# EAGLE design ADE9000_ESP32_DevKitC (EAGLE 9.6.2)

## Sheet 1 of 2
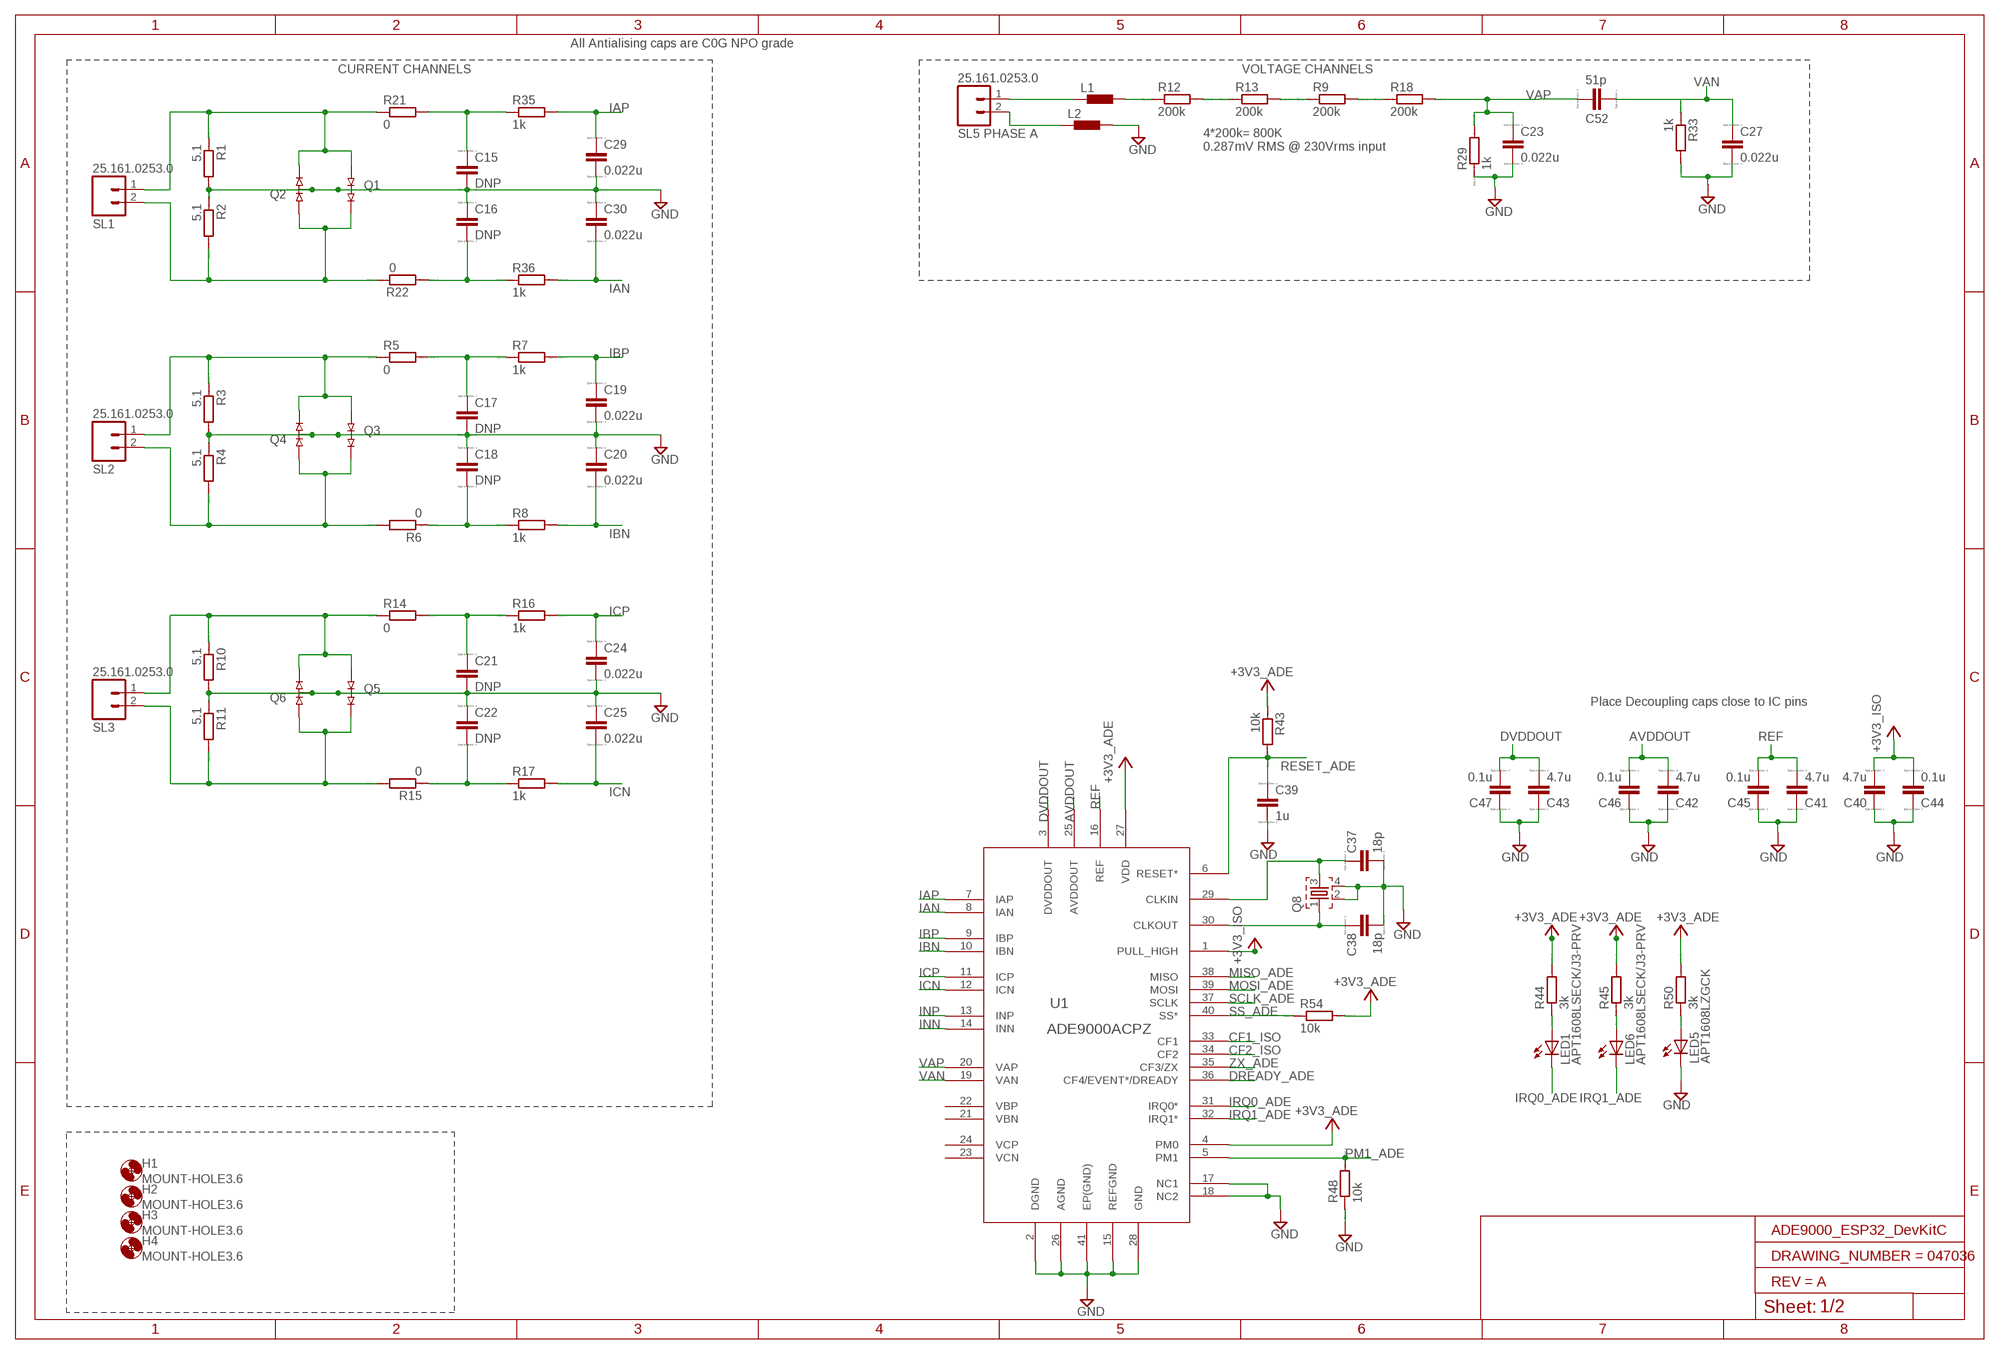
[diagram p0: schematic, sheet 1]
FRAME1 (A3L-LOC): DRAWING_NUMBER: 047036; REV: A

### Parts
C15  DNP  C  [C0805]
C16  DNP  C  [C0805]
C17  DNP  C  [C0805]
C18  DNP  C  [C0805]
C19  0.022u  C  [C0805]
C20  0.022u  C  [C0805]
C21  DNP  C  [C0805]
C22  DNP  C  [C0805]
C23  0.022u  C  [C0805]
C24  0.022u  C  [C0805]
C25  0.022u  C  [C0805]
C27  0.022u  C  [C0805]
C29  0.022u  C  [C0805]
C30  0.022u  C  [C0805]
C37  18p  CC0402  [C0402]
C38  18p  CC0402  [C0402]
C39  1u  CC0603  [C0603]
C40  4.7u  C  [C0805]
C41  4.7u  CC0603  [C0603]
C42  4.7u  CC0603  [C0603]
C43  4.7u  CC0603  [C0603]
C44  0.1u  CC0603  [C0603]
C45  0.1u  CC0603  [C0603]
C46  0.1u  CC0603  [C0603]
C47  0.1u  CC0603  [C0603]
C52  51p  CC0402  [C0402]
H1  MOUNT-HOLE3.6  [3,6]
H2  MOUNT-HOLE3.6  [3,6]
H3  MOUNT-HOLE3.6  [3,6]
H4  MOUNT-HOLE3.6  [3,6]
L1  1500  FERRITE_BEAD0805  [M0805]
L2  1500  FERRITE_BEAD0805  [M0805]
LED1  APT1608LSECK/J3-PRV  LEDSML0603  [SML0603]
LED5  APT1608LZGCK  LEDSML0603  [SML0603]
LED6  APT1608LSECK/J3-PRV  LEDSML0603  [SML0603]
Q1  MMBD4148SE  DUAL_DIODE_SOT23-3  [SOT23-3]
Q2  MMBD4148SE  DUAL_DIODE_SOT23-3  [SOT23-3]
Q3  MMBD4148SE  DUAL_DIODE_SOT23-3  [SOT23-3]
Q4  MMBD4148SE  DUAL_DIODE_SOT23-3  [SOT23-3]
Q5  MMBD4148SE  DUAL_DIODE_SOT23-3  [SOT23-3]
Q6  MMBD4148SE  DUAL_DIODE_SOT23-3  [SOT23-3]
Q8  ECS-245.7-12-33Q-JES-TR  CRYSTAL_SMD128  [SMD_4PIN_3.2X2.1]
R1  5.1  R  [R0805]
R2  5.1  R  [R0805]
R3  5.1  R  [R0805]
R4  5.1  R  [R0805]
R5  0  RR0603  [R0603]
R6  0  RR0603  [R0603]
R7  1k  RR0603  [R0603]
R8  1k  RR0603  [R0603]
R9  200k  RR2010  [R2010]
R10  5.1  R  [R0805]
R11  5.1  R  [R0805]
R12  200k  RR2010  [R2010]
R13  200k  RR2010  [R2010]
R14  0  RR0603  [R0603]
R15  0  RR0603  [R0603]
R16  1k  RR0603  [R0603]
R17  1k  RR0603  [R0603]
R18  200k  RR2010  [R2010]
R21  0  RR0603  [R0603]
R22  0  RR0603  [R0603]
R29  1k  RR0603  [R0603]
R33  1k  RR0603  [R0603]
R35  1k  RR0603  [R0603]
R36  1k  RR0603  [R0603]
R43  10k  RR0603  [R0603]
R44  3k  RR0603  [R0603]
R45  3k  RR0603  [R0603]
R48  10k  RR0603  [R0603]
R50  3k  RR0603  [R0603]
R54  10k  RR0603  [R0603]
SL1  25.161.0253.0  M02  [02P]
SL2  25.161.0253.0  M02  [02P]
SL3  25.161.0253.0  M02  [02P]
SL5  25.161.0253.0  M02  [02P]
U1  ADE9000ACPZ  [CP_40_7]

### Nets
+3V3: C40.2 C44.2 R43.1 R44.2 R45.2 R50.2 R54.2 U1.1(PULL_HIGH) U1.4(PM0) U1.27(VDD) ; supply symbol labelled +3V3_ADE, +3V3_ISO ; also sheet 2
AVDDOUT: C42.2 C46.2 U1.25(AVDDOUT)
CF1_ISO: U1.33(CF1)
CF2_ISO: U1.34(CF2)
DREADY_ADE: U1.36(CF4/EVENT*/DREADY) ; also sheet 2
DVDDOUT: C43.2 C47.2 U1.3(DVDDOUT)
GND: C15.2 C16.1 C17.2 C18.1 C19.2 C20.1 C21.2 C22.1 C23.2 C24.2 C25.1 C27.2 C29.2 C30.1 C37.2 C38.2 C39.2 C40.1 C41.1 C42.1 C43.1 C44.1 C45.1 C46.1 C47.1 L2.2 LED5.C Q1.3 Q2.3 Q3.3 Q4.3 Q5.3 Q6.3 Q8.2 Q8.4 R1.2 R2.1 R3.2 R4.1 R10.2 R11.1 R29.1 R33.2 R48.1 U1.2(DGND) U1.15(REFGND) U1.17(NC1) U1.18(NC2) U1.26(AGND) U1.28(GND) U1.41(EP(GND)) ; also sheet 2
IAN: C30.2 R36.2 U1.8(IAN)
IAP: C29.1 R35.2 U1.7(IAP)
IBN: C20.2 R8.2 U1.10(IBN)
IBP: C19.1 R7.2 U1.9(IBP)
ICN: C25.2 R17.2 U1.12(ICN)
ICP: C24.1 R16.2 U1.11(ICP)
INN: U1.14(INN)
INP: U1.13(INP)
IRQ0_ADE: LED1.C U1.31(IRQ0*) ; also sheet 2
IRQ1_ADE: LED6.C U1.32(IRQ1*) ; also sheet 2
MISO_ADE: U1.38(MISO) ; also sheet 2
MOSI_ADE: U1.39(MOSI) ; also sheet 2
N$1: C37.1 Q8.3 U1.29(CLKIN)
N$2: C38.1 Q8.1 U1.30(CLKOUT)
N$3: Q3.1 Q4.2 R3.1 R5.1 SL2.1
N$4: Q3.2 Q4.1 R4.2 R6.2 SL2.2
N$6: C18.2 R6.1 R8.1
N$7: Q1.1 Q2.2 R1.1 R21.1 SL1.1
N$9: C17.1 R5.2 R7.1
N$11: Q5.1 Q6.2 R10.1 R14.1 SL3.1
N$13: Q5.2 Q6.1 R11.2 R15.2 SL3.2
N$14: C16.2 R22.1 R36.1
N$15: L2.1 SL5.2
N$17: C22.2 R15.1 R17.1
N$18: C21.1 R14.2 R16.1
N$27: LED1.A R44.1
N$28: LED6.A R45.1
N$35: L1.2 R12.1
N$36: R12.2 R13.1
N$37: R9.1 R13.2
N$38: R9.2 R18.1
N$40: Q1.2 Q2.1 R2.2 R22.2 SL1.2
N$41: C15.1 R21.2 R35.1
N$50: LED5.A R50.1
N$67: L1.1 SL5.1
PM1_ADE: R48.2 U1.5(PM1) ; also sheet 2
REF: C41.2 C45.2 U1.16(REF)
RESET_ADE: C39.1 R43.2 U1.6(RESET*) ; also sheet 2
SCLK_ADE: U1.37(SCLK) ; also sheet 2
SS_ADE: R54.1 U1.40(SS*) ; also sheet 2
VAN: C27.1 C52.1 R33.1 U1.19(VAN)
VAP: C23.1 C52.2 R18.2 R29.2 U1.20(VAP)
ZX_ADE: U1.35(CF3/ZX) ; also sheet 2
Unconnected: U1.21(VBN) U1.22(VBP) U1.23(VCN) U1.24(VCP)

### Notes on the sheet
- All Antialising caps are C0G NPO grade
- CURRENT CHANNELS | VOLTAGE CHANNELS
- PHASE A
- 4*200k= 800K
  0.287mV RMS @ 230Vrms input
- Place Decoupling caps close to IC pins

## Sheet 2 of 2
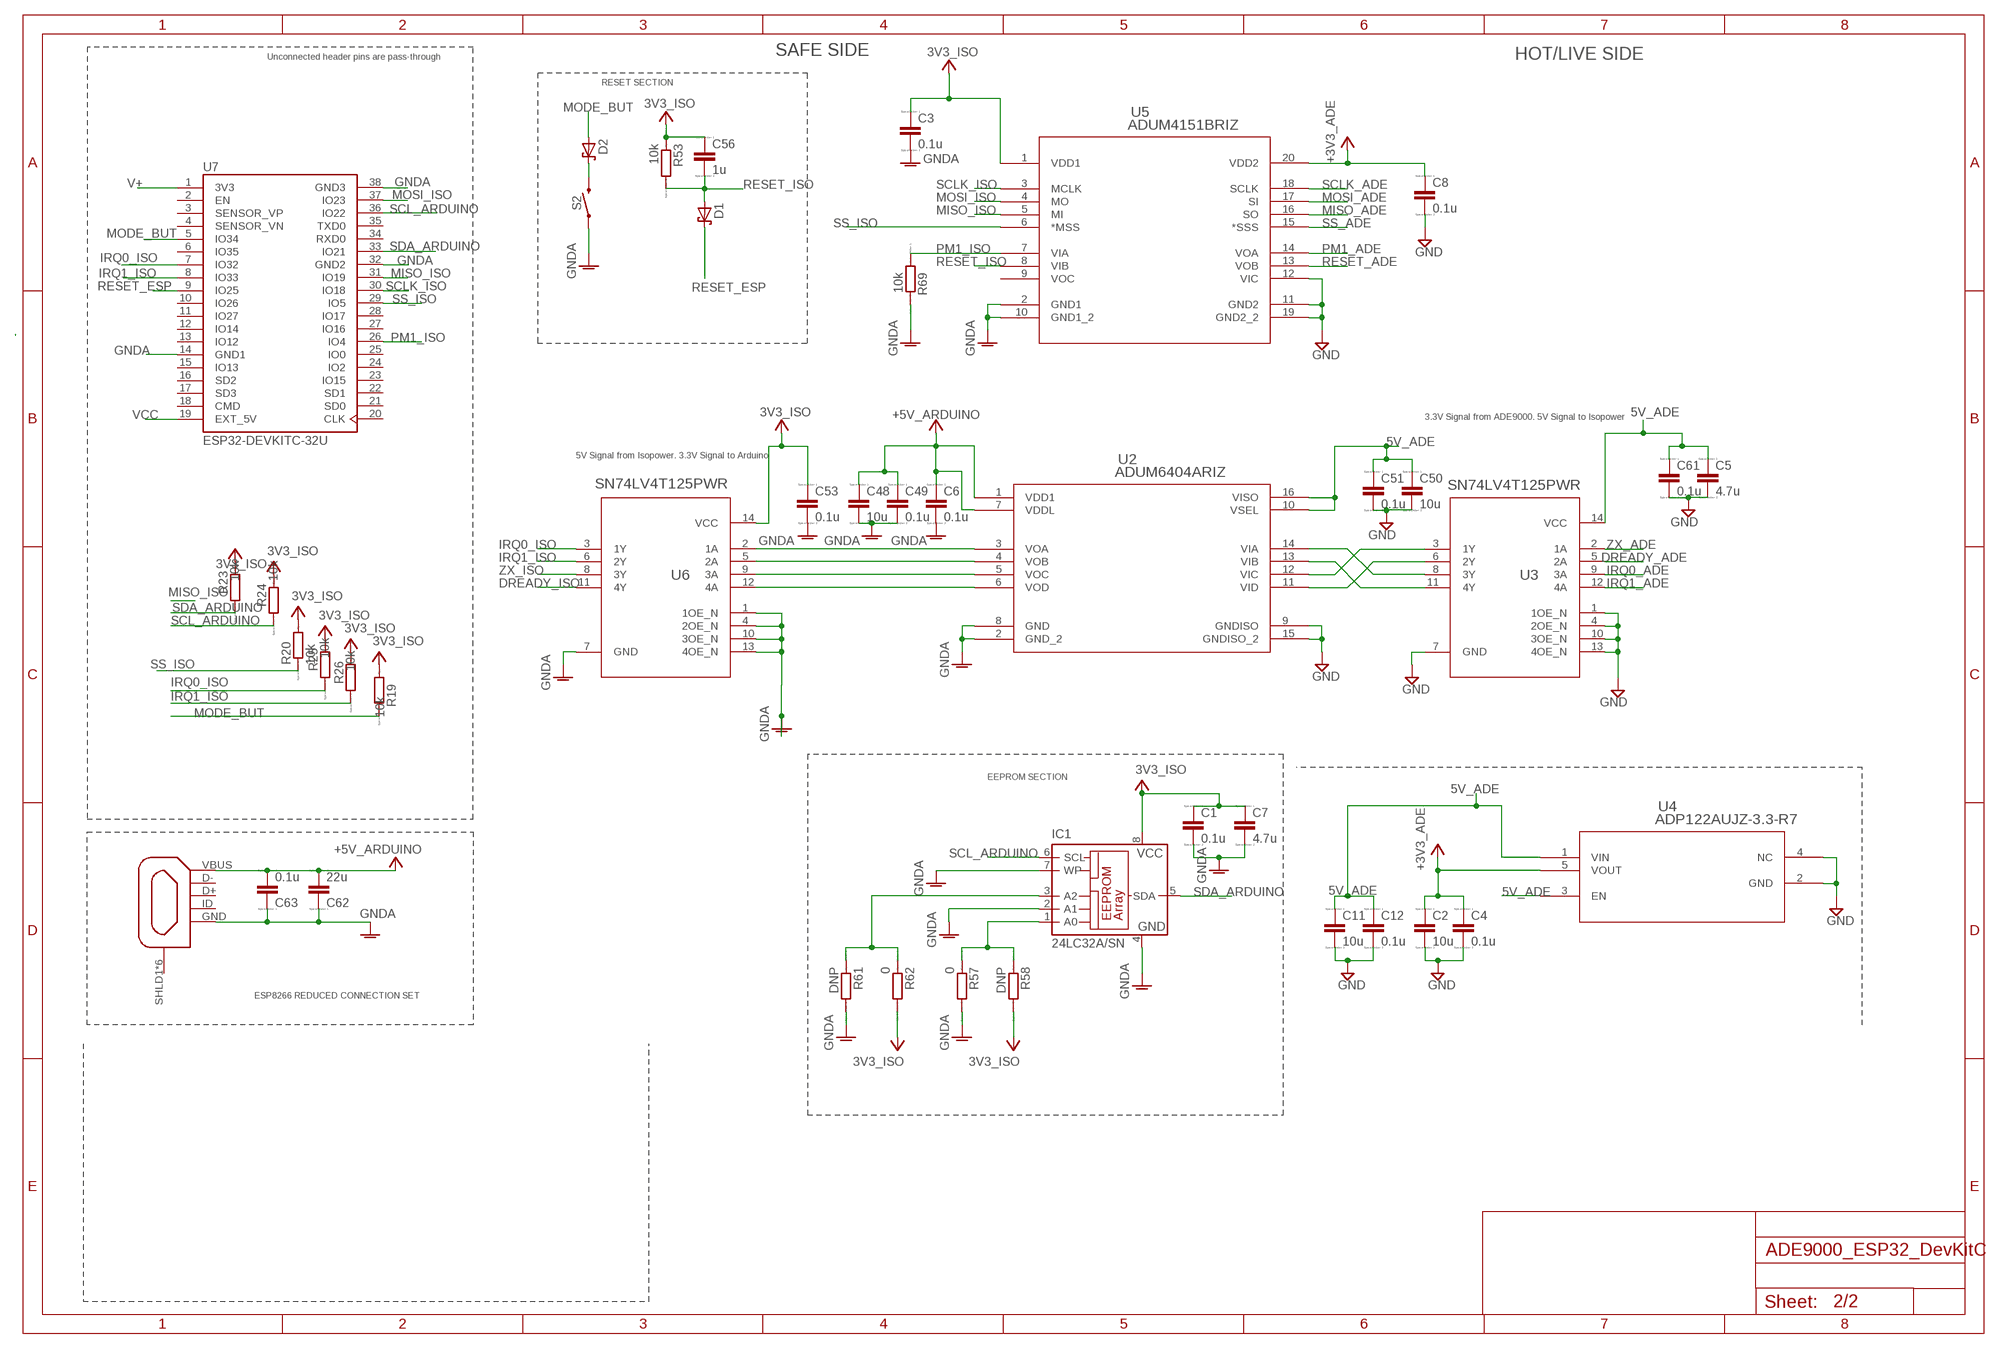
[diagram p1: schematic, sheet 2]

### Parts
C1  0.1u  CC0603  [C0603]
C2  10u  C  [C0805]
C3  0.1u  CC0603  [C0603]
C4  0.1u  CC0603  [C0603]
C5  4.7u  C  [C0805]
C6  0.1u  CC0603  [C0603]
C7  4.7u  C  [C0805]
C8  0.1u  CC0603  [C0603]
C11  10u  C  [C0805]
C12  0.1u  CC0603  [C0603]
C48  10u  C  [C0805]
C49  0.1u  CC0603  [C0603]
C50  10u  C  [C0805]
C51  0.1u  CC0603  [C0603]
C53  0.1u  CC0603  [C0603]
C56  1u  CC0603  [C0603]
C61  0.1u  CC0603  [C0603]
C62  22u  C  [C0805]
C63  0.1u  CC0603  [C0603]
D1  BAT54WS  BAT60J  [SOD323_ST]
D2  BAT54WS  BAT60J  [SOD323_ST]
IC1  24LC32A/SN  24LC32ASN  [SO-08]
J9  ZX62-AB-5PA(31)  USB_MICRO  [USB-MICRO-10103594]
R19  10k  RR0603  [R0603]
R20  10k  RR0603  [R0603]
R23  10k  RR0603  [R0603]
R24  10k  RR0603  [R0603]
R25  10k  RR0603  [R0603]
R26  10k  RR0603  [R0603]
R53  10k  RR0603  [R0603]
R57  0  RR0603  [R0603]
R58  DNP  RR0603  [R0603]
R61  DNP  RR0603  [R0603]
R62  0  RR0603  [R0603]
R69  10k  RR0603  [R0603]
S2  PTS645SM43SMTR92  MOMENTARY-SWITCH-SPST-SMD-6.2MM-TALL  [TACTILE_SWITCH_SMD_6.2MM_TALL]
U2  ADUM6404ARIZ  [RI_16_1]
U3  SN74LV4T125PWR  [PW0014A_N]
U4  ADP122AUJZ-3.3-R7  [UJ_5]
U5  ADUM4151BRIZ  ADUM4151ARIZ  [RI_20_1]
U6  SN74LV4T125PWR  [PW0014A_N]
U7  ESP32-DEVKITC-32U  [MODULE_ESP32-DEVKITC-32U]

### Nets
5V_ADE: C5.1 C11.1 C12.1 C50.1 C51.1 C61.1 U2.10(VSEL) U2.16(VISO) U3.14(VCC) U4.1(VIN) U4.3(EN)
+3V3: C2.1 C4.1 C8.1 U4.5(VOUT) U5.20(VDD2) ; supply symbol labelled +3V3_ADE ; also sheet 1
DREADY_ADE: U3.5(2A) ; also sheet 1
DREADY_ISO: U6.11(4Y)
GND: C2.2 C4.2 C5.2 C8.2 C11.2 C12.2 C50.2 C51.2 C61.2 U2.9(GNDISO) U2.15(GNDISO_2) U3.1(1OE_N) U3.4(2OE_N) U3.7(GND) U3.10(3OE_N) U3.13(4OE_N) U4.2(GND) U4.4(NC) U5.11(GND2) U5.12(VIC) U5.19(GND2_2) ; also sheet 1
GNDA: C1.2 C3.2 C6.2 C7.2 C48.2 C49.2 C53.2 C62.1 C63.1 IC1.2(A1) IC1.4(GND) IC1.7(WP) J9.GND R57.2 R61.2 R69.2 S2.A2 U2.2(GND_2) U2.8(GND) U5.2(GND1) U5.10(GND1_2) U6.1(1OE_N) U6.4(2OE_N) U6.7(GND) U6.10(3OE_N) U6.13(4OE_N) U7.14(GND1) U7.32(GND2) U7.38(GND3)
IRQ0_ADE: U3.9(3A) ; also sheet 1
IRQ0_ISO: R25.1 U6.3(1Y) U7.7(IO32)
IRQ1_ADE: U3.12(4A) ; also sheet 1
IRQ1_ISO: R26.1 U6.6(2Y) U7.8(IO33)
MISO_ADE: U5.16(SO) ; also sheet 1
MISO_ISO: U5.5(MI) U7.31(IO19)
MODE_BUT: D2.A R19.2 U7.5(IO34)
MOSI_ADE: U5.17(SI) ; also sheet 1
MOSI_ISO: U5.4(MO) U7.37(IO23)
N$8: IC1.3(A2) R61.1 R62.1
N$10: D2.C S2.B2
N$30: U2.14(VIA) U3.8(3Y)
N$31: U2.13(VIB) U3.11(4Y)
N$44: U2.12(VIC) U3.3(1Y)
N$49: U2.11(VID) U3.6(2Y)
N$57: U2.3(VOA) U6.2(1A)
N$58: U2.4(VOB) U6.5(2A)
N$59: U2.5(VOC) U6.9(3A)
N$60: U2.6(VOD) U6.12(4A)
N$76: IC1.1(A0) R57.1 R58.1
PM1_ADE: U5.14(VOA) ; also sheet 1
PM1_ISO: R69.1 U5.7(VIA) U7.26(IO4)
RESET_ADE: U5.13(VOB) ; also sheet 1
RESET_ESP: D1.C U7.9(IO25)
RESET_ISO: C56.2 D1.A R53.2 U5.8(VIB)
SCL_ARDUINO: IC1.6(SCL) R24.1 U7.36(IO22)
SCLK_ADE: U5.18(SCLK) ; also sheet 1
SCLK_ISO: U5.3(MCLK) U7.30(IO18)
SDA_ARDUINO: IC1.5(SDA) R23.1 U7.33(IO21)
SS_ADE: U5.15(*SSS) ; also sheet 1
SS_ISO: R20.1 U5.6(*MSS) U7.29(IO5)
V+: C1.1 C3.1 C7.1 C53.1 C56.1 IC1.8(VCC) R19.1 R20.2 R23.2 R24.2 R25.2 R26.2 R53.1 R58.2 R62.2 U5.1(VDD1) U6.14(VCC) U7.1(3V3) ; supply symbol labelled 3V3_ISO
VCC: C6.1 C48.1 C49.1 C62.2 C63.2 J9.VBUS U2.1(VDD1) U2.7(VDDL) U7.19(EXT_5V) ; supply symbol labelled +5V_ARDUINO
ZX_ADE: U3.2(1A) ; also sheet 1
ZX_ISO: U6.8(3Y)
Unconnected: J9.D+ J9.D- J9.ID J9.SHLD1(SHLD1*6) J9.SHLD2(SHLD1*6) J9.SHLD3(SHLD1*6) J9.SHLD4(SHLD1*6) J9.SHLD5(SHLD1*6) J9.SHLD6(SHLD1*6) U5.9(VOC) U7.2(EN) U7.3(SENSOR_VP) U7.4(SENSOR_VN) U7.6(IO35) U7.10(IO26) U7.11(IO27) U7.12(IO14) U7.13(IO12) U7.15(IO13) U7.16(SD2) U7.17(SD3) U7.18(CMD) U7.20(CLK) U7.21(SD0) U7.22(SD1) U7.23(IO15) U7.24(IO2) U7.25(IO0) U7.27(IO16) U7.28(IO17) U7.34(RXD0) U7.35(TXD0)

### Notes on the sheet
- SAFE SIDE
- Unconnected header pins are pass-through | HOT/LIVE SIDE
- RESET SECTION
- 3.3V Signal from ADE9000. 5V Signal to Isopower
- 5V Signal from Isopower. 3.3V Signal to Arduino
- EEPROM SECTION
- ESP8266 REDUCED CONNECTION SET

## Library data of the parts
C1-C8 C11 C12 C48-C51 C53 C61-C63 = eagle-ltspice:C: CAPACITOR, European symbol; SPICEMODEL: NONE; SPICEPREFIX: C
C15-C25 C27 C29 C30 C37-C47 C52 C56 = capacitors:C: CAPACITOR, European symbol; SPICEMODEL: NONE; SPICEPREFIX: C
D1 D2 = diode:BAT60J: Schottky barrier diode Source: www.st.com, BAT60J.pdf
H1-H4 = holes:MOUNT-HOLE: MOUNTING HOLE with drill center marker
IC1 = microchip:24*: Serial EEPROM I2C; MF: MICROCHIP; MPN: 24LC32A/SN; OC_FARNELL: 9758003; OC_NEWARK: 33C2976
J9 = connectors:USB_MICRO; MANUFACTURER: Hirose Electric; MFRPART#: ZX62-AB-5PA(31)
L1 L2 = inductors:FERRITE_BEAD; DIGIKEY: 490-1048-1-ND
LED1 LED6 = DIODE_LED:LED: LED OSRAM: - CHIPLED LG R971, LG N971, LY N971, LG Q971, LY Q971, LO R971, LY R971 LH N974, LH R974 LS Q976, LO Q976, LY Q976 LO Q996 - Hyper CHIPLED LW Q18S LB Q993, LB Q99A, LB R99A - SideLED LS A670, LO A670, LY A670, LG A670, LP A670 LB A673, LV A673, LT A673, LW A673 LH A674 LY A675 LS A676, LA A676, LO A676, LY A676, LW A676 LS A679, LY A679, LG A679 - Hyper Micro SIDELED® LS Y876, LA Y876, LO Y876, LY Y876 LT Y87S - SmartLED LW L88C, LW L88S LB L89C, LB L89S, LG L890 LS L89K, LO L89K, LY L89K LS L896, LA L896, LO L896, LY L896 - TOPLED LS T670, LO T670, LY T670, LG T670, LP T670 LSG T670, LSP T670, LSY T670, LOP T670, LYG T670 LG T671, LOG T671, LSG T671 LB T673, LV T673, LT T673, LW T673 LH T674 LS T676, LA T676, LO T676, LY T676, LB T676, LH T676, LSB T676, LW T676 LB T67C, LV T67C, LT T67C, LS T67K, LO T67K, LY T67K, LW E67C LS E67B, LA E67B, LO E67B, LY E67B, LB E67C, LV E67C, LT E67C LW T67C LS T679, LY T679, LG T679 LS T770, LO T770, LY T770, LG T770, LP T770 LB T773, LV T773, LT T773, LW T773 LH T774 LS E675, LA E675, LY E675, LS T675 LS T776, LA T776, LO T776, LY T776, LB T776 LHGB T686 LT T68C, LB T68C - Hyper Mini TOPLED® LB M676 - Mini TOPLED Santana® LG M470 LS M47K, LO M47K, LY M47K Source: http://www.osram.convergy.de LUXEON: - LUMILED® LXK2-PW12-R00, LXK2-PW12-S00, LXK2-PW14-U00, LXK2-PW14-V00 LXK2-PM12-R00, LXK2-PM12-S00, LXK2-PM14-U00 LXK2-PE12-Q00, LXK2-PE12-R00, LXK2-PE12-S00, LXK2-PE14-T00, LXK2-PE14-U00 LXK2-PB12-K00, LXK2-PB12-L00, LXK2-PB12-M00, LXK2-PB14-N00, LXK2-PB14-P00, LXK2-PB14-Q00 LXK2-PR12-L00, LXK2-PR12-M00, LXK2-PR14-Q00, LXK2-PR14-R00 LXK2-PD12-Q00, LXK2-PD12-R00, LXK2-PD12-S00 LXK2-PH12-R00, LXK2-PH12-S00 LXK2-PL12-P00, LXK2-PL12-Q00, LXK2-PL12-R00 Source: www.luxeon.com KINGBRIGHT: KA-3528ASYC Source: www.kingbright.com; PARTNO: APT1608LSECK/J3-PRV
LED5 = DIODE_LED:LED: LED OSRAM: - CHIPLED LG R971, LG N971, LY N971, LG Q971, LY Q971, LO R971, LY R971 LH N974, LH R974 LS Q976, LO Q976, LY Q976 LO Q996 - Hyper CHIPLED LW Q18S LB Q993, LB Q99A, LB R99A - SideLED LS A670, LO A670, LY A670, LG A670, LP A670 LB A673, LV A673, LT A673, LW A673 LH A674 LY A675 LS A676, LA A676, LO A676, LY A676, LW A676 LS A679, LY A679, LG A679 - Hyper Micro SIDELED® LS Y876, LA Y876, LO Y876, LY Y876 LT Y87S - SmartLED LW L88C, LW L88S LB L89C, LB L89S, LG L890 LS L89K, LO L89K, LY L89K LS L896, LA L896, LO L896, LY L896 - TOPLED LS T670, LO T670, LY T670, LG T670, LP T670 LSG T670, LSP T670, LSY T670, LOP T670, LYG T670 LG T671, LOG T671, LSG T671 LB T673, LV T673, LT T673, LW T673 LH T674 LS T676, LA T676, LO T676, LY T676, LB T676, LH T676, LSB T676, LW T676 LB T67C, LV T67C, LT T67C, LS T67K, LO T67K, LY T67K, LW E67C LS E67B, LA E67B, LO E67B, LY E67B, LB E67C, LV E67C, LT E67C LW T67C LS T679, LY T679, LG T679 LS T770, LO T770, LY T770, LG T770, LP T770 LB T773, LV T773, LT T773, LW T773 LH T774 LS E675, LA E675, LY E675, LS T675 LS T776, LA T776, LO T776, LY T776, LB T776 LHGB T686 LT T68C, LB T68C - Hyper Mini TOPLED® LB M676 - Mini TOPLED Santana® LG M470 LS M47K, LO M47K, LY M47K Source: http://www.osram.convergy.de LUXEON: - LUMILED® LXK2-PW12-R00, LXK2-PW12-S00, LXK2-PW14-U00, LXK2-PW14-V00 LXK2-PM12-R00, LXK2-PM12-S00, LXK2-PM14-U00 LXK2-PE12-Q00, LXK2-PE12-R00, LXK2-PE12-S00, LXK2-PE14-T00, LXK2-PE14-U00 LXK2-PB12-K00, LXK2-PB12-L00, LXK2-PB12-M00, LXK2-PB14-N00, LXK2-PB14-P00, LXK2-PB14-Q00 LXK2-PR12-L00, LXK2-PR12-M00, LXK2-PR14-Q00, LXK2-PR14-R00 LXK2-PD12-Q00, LXK2-PD12-R00, LXK2-PD12-S00 LXK2-PH12-R00, LXK2-PH12-S00 LXK2-PL12-P00, LXK2-PL12-Q00, LXK2-PL12-R00 Source: www.luxeon.com KINGBRIGHT: KA-3528ASYC Source: www.kingbright.com; PARTNO: APT1608LZGCK
Q1-Q6 = DIODE_LED:DUAL_DIODE; DIGIKEY: MMBD4148SECT-ND
Q8 = crystals:CRYSTAL_SMD; DIGIKEY: XC2178CT-ND
R1 = eagle-ltspice:R: RESISTOR, European symbol; DESCRIPTION: RES, 5.1, 0W1, 0%1, 0805-SMT, ROHS; MANUFACTURER: TE Connectivity Passive Product; MFR_PART_NO_#: CPF0805B5R1E1; SPICEMODEL: NONE; SPICEPREFIX: R
R2-R26 R29 R33 R35 R36 R43-R45 R48 R50 R53 R54 R57 R58 R61 R62 R69 = eagle-ltspice:R: RESISTOR, European symbol; SPICEMODEL: NONE; SPICEPREFIX: R
S2 = SparkFun-Switches:MOMENTARY-SWITCH-SPST: Momentary Switch (Pushbutton) - SPST Normally-open (NO) SPST momentary switches (buttons, pushbuttons). Variants PTH-12MM - 12mm square, through-hole Momentary Pushbutton Switch - 12mm Square <https://www.sparkfun.com/products/9190> (COM-09190) PTH-6.0MM, PTH-6.0MM-KIT - 6.0mm square, through-hole Mini Pushbutton Switch <https://www.sparkfun.com/products/97> (COM-00097) KIT package intended for soldering kit's - only one side of pads' copper is exposed. PTH-RIGHT-ANGLE-KIT - Right-angle, through-hole Right Angle Tactile Button <https://www.sparkfun.com/products/10791> - Used on SparkFun BigTime Watch Kit <https://www.sparkfun.com/products/11734> SMD-12MM - 12mm square, surface-mount Tactile Button - SMD (12mm) <https://www.sparkfun.com/products/12993> (COM-12993) Used on SparkFun PicoBoard <https://www.sparkfun.com/products/11888> SMD-4.5MM - 4.5mm Square Trackball Switch Used on SparkFun Blackberry Trackballer Breakout <https://www.sparkfun.com/products/13169> SMD-4.6MMX2.8MM - 4.60mm x 2.80mm, surface mount Used on SparkFun SAMD21 Mini Breakout <https://www.sparkfun.com/products/13664> SMD-5.2MM, SMD-5.2-REDUNDANT - 5.2mm square, surface-mount Mini Pushbutton Switch - SMD <https://www.sparkfun.com/products/8720> (COM-08720) Used on Arduino Pro Mini <https://www.sparkfun.com/products/11114> REDUNDANT package connects both switch circuits together SMD-6.0X3.5MM - 6.0 x 3.5mm, surface mount Momentary Reset Switch SMD <https://www.sparkfun.com/products/8229> (COM-08229) SMD-6.2MM-TALL - 6.2mm square, surface mount Tactile Button - SMD (6mm) <https://www.sparkfun.com/products/12992> Used on SparkFun Digital Sandbox <https://www.sparkfun.com/products/12651> SMD-RIGHT-ANGLE - Right-angle, surface mount Used on SparkFun Block for Intel® Edison - Arduino <https://www.sparkfun.com/products/13036>; PROD_ID: SWCH-11966; SF_SKU: COM-12992
SL1-SL3 SL5 = GEEC_LibrariesCon_GEEC_Voltage:M02: AMP QUICK CONNECTOR; OC_FARNELL: unknown; OC_NEWARK: unknown
U1 = IC:ADE9000ACPZ; DIGIKEY: ADE9000ACPZ-RLCT-ND
U2 = IC:ADUM6404ARIZ
U3 U6 = IC:SN74LV4T125PWR; COMPTYPE: IC; MANUFACTURER: Texas Instruments; MOUNTTYPE: SMT; PACKAGEREFERENCE: PW0014A; PARTNUMBER: SN74LV4T125PWR; PIN_COUNT: 14; REFDES: RefDes; ROHS: Y; TYPE: TYPE; VALUE: Value
U4 = IC:ADP122AUJZ-3.3-R7
U5 = IC:ADUM4151ARIZ
U7 = ESP32-DEVKITC-32U:ESP32-DEVKITC-32U: Check availability <https://pricing.snapeda.com/parts/ESP32-DEVKITC-32U/Espressif%20Systems/view-part?ref=eda>; AVAILABILITY: In Stock; CHECK_PRICES: https://www.snapeda.com/parts/ESP32-DEVKITC-32U/Espressif+Systems/view-part/?ref=eda; DESCRIPTION: ESP-WROOM-32 - 802.11 b/g/n (WiFi/WLAN/Wi-Fi 4), Bluetooth® Smart 4.x Low Energy (BLE) RF (Transceiver) 2.4GHz Evaluation Board; MF: Espressif Systems; MP: ESP32-DEVKITC-32U; PACKAGE: CUSTOM-38 ESPRESSIF; PRICE: None; SNAPEDA_LINK: https://www.snapeda.com/parts/ESP32-DEVKITC-32U/Espressif+Systems/view-part/?ref=snap

## Board
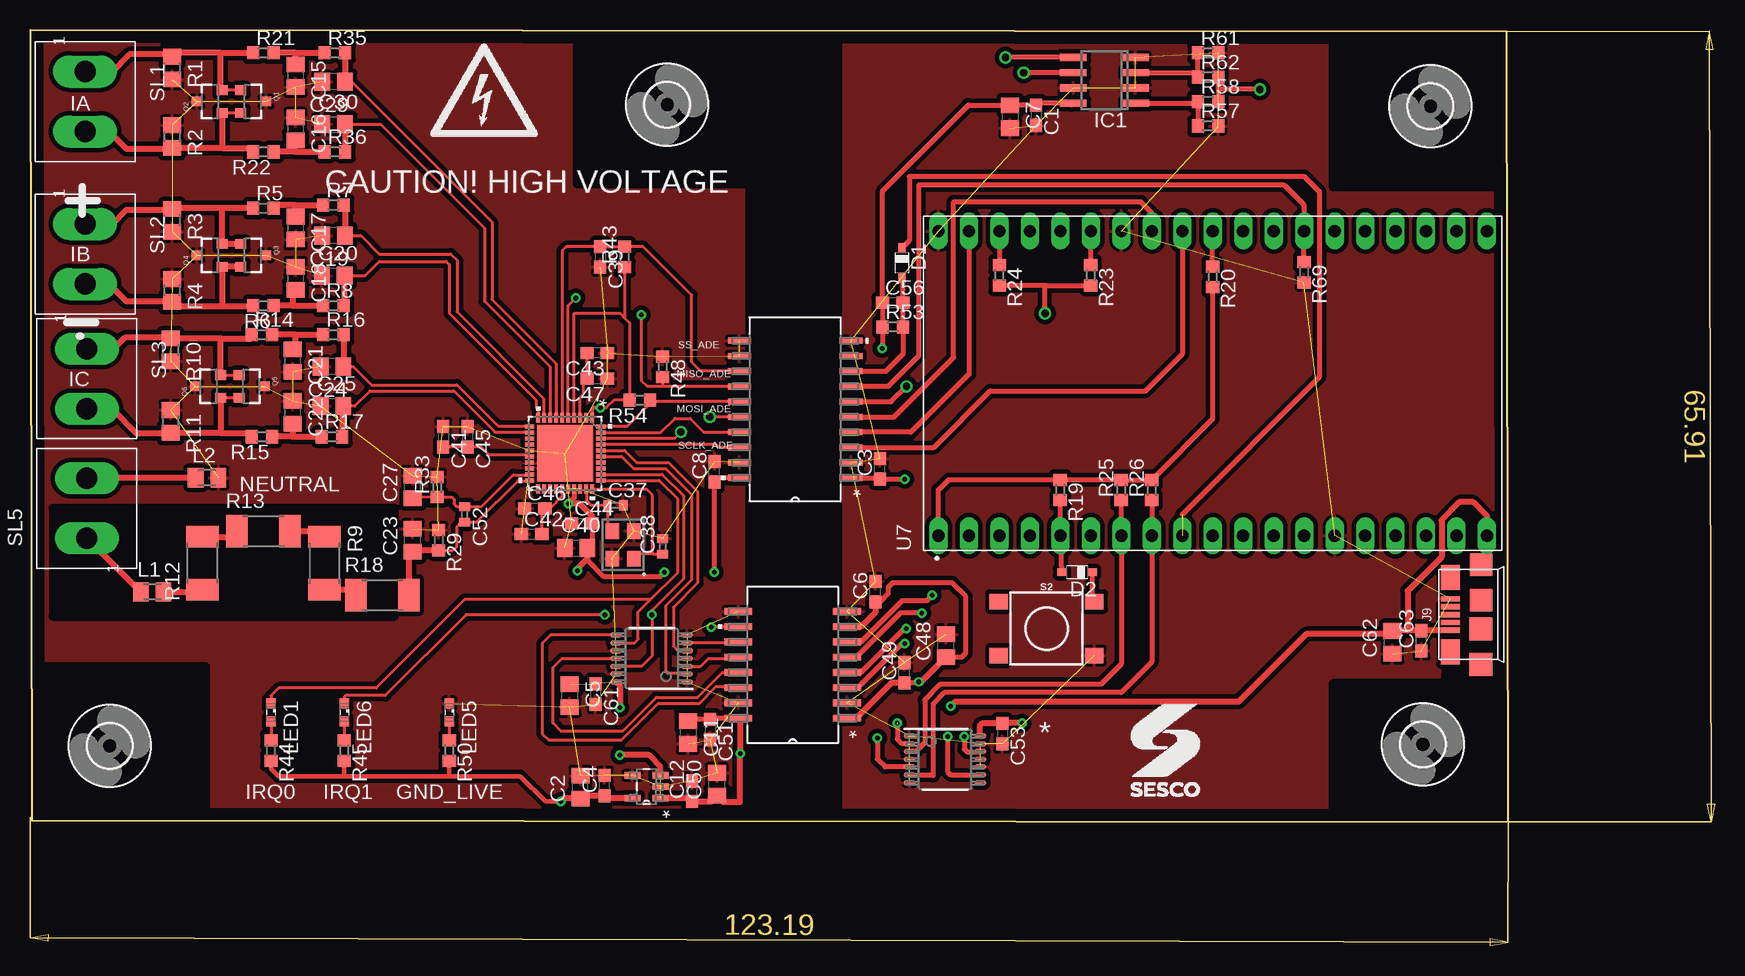
[diagram p2: board, top side]
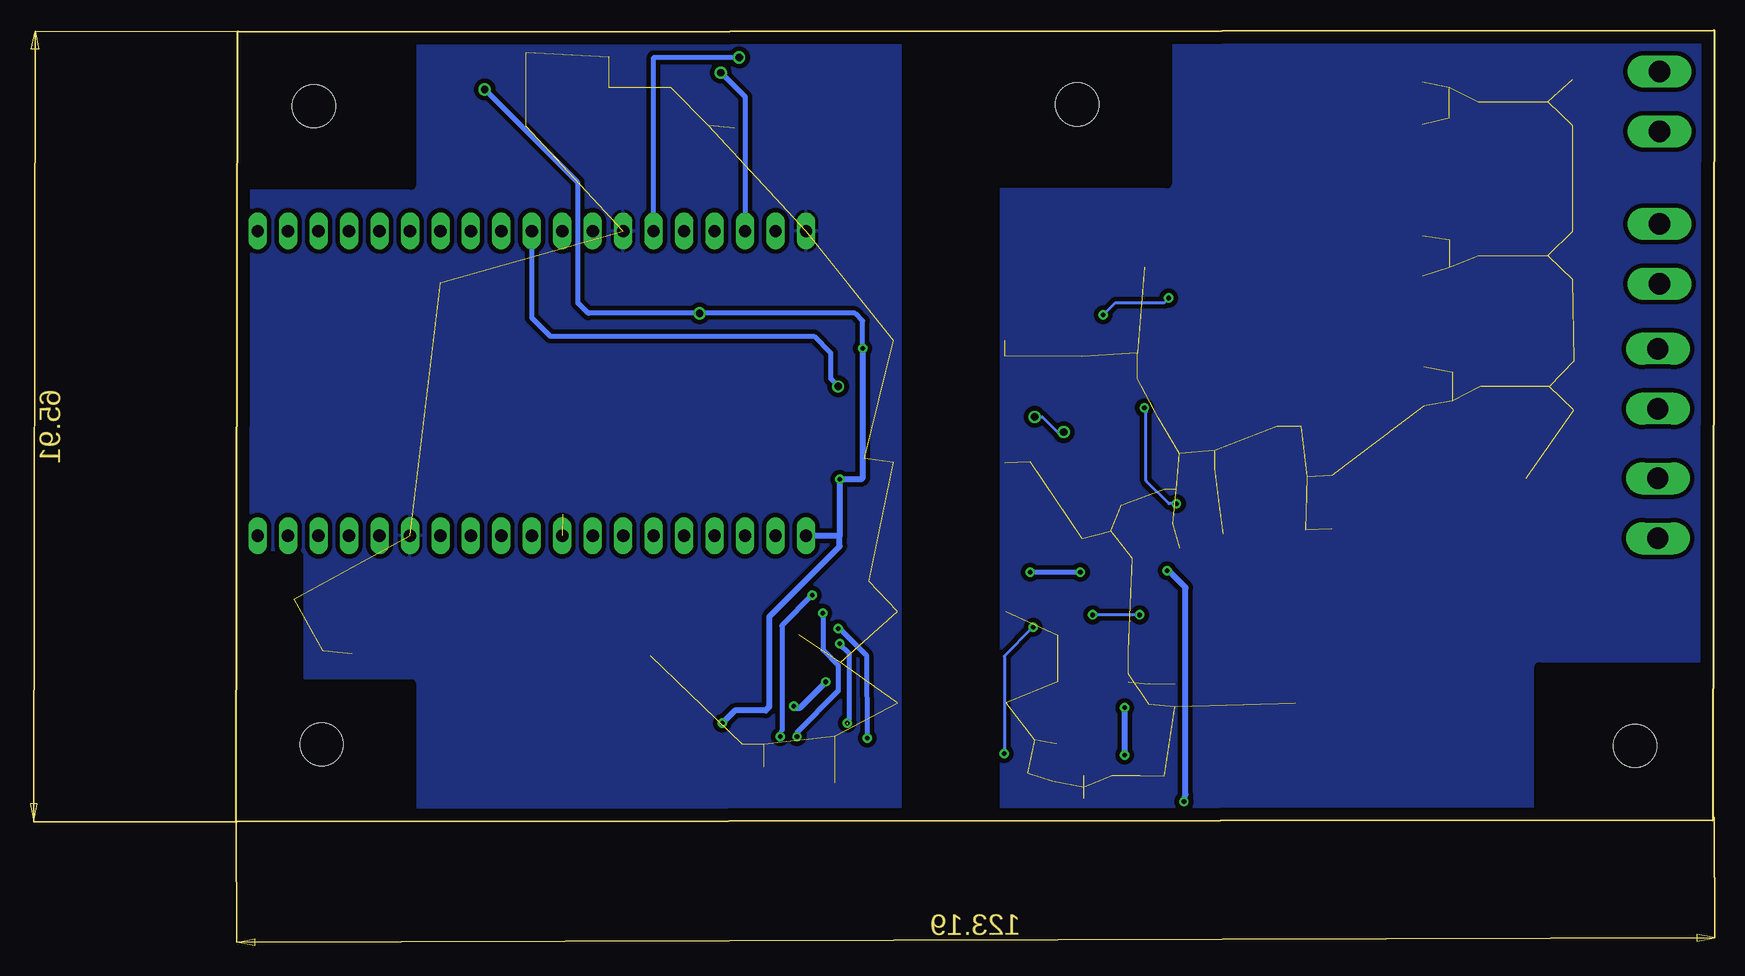
[diagram p3: board, bottom side, seen from below]

Size 123.19 x 66.04 mm. Coordinates in mm from the lower left corner, seen from the top.
Outline: 0.13,0.13 123.19,0 123.06,65.91 0,66.04 0.13,0.13
Copper layers (1*16): Top 0.035mm / dielectric 1.5mm / Bottom 0.035mm
Design rules "default": minimum track width 10mil, minimum drill 24mil, track to track 8mil, track to pad 8mil, pad to pad 8mil, via to via 8mil, smd to smd 8mil, copper to edge 40mil, drill to drill 8mil, minimum pad ring 10mil, minimum via ring 8mil, stop-mask expansion 4mil, vias tented up to drill 0mil, thermal gap 10mil
tRestrict: area 1.9,17.1 to 30.4,26.2; area 0.4,0.3 to 14.6,13; area 108.6,0.3 to 122.8,11.6; area 108.6,53 to 122.8,65.7; area 45.6,53.2 to 59.8,65.9; area 118,12.2 to 121,22.2; area 59.9,0 to 67.3,66.2
bRestrict: area 0.4,0.3 to 14.6,13; area 108.6,0.3 to 122.8,11.6; area 108.6,53.1 to 122.8,65.8; area 45.6,53.2 to 59.8,65.9; area 118,12.2 to 121,22.2; area 59.9,0 to 67.3,66.2

### Footprints (pad centres in the part's own frame; a part is rotated, then mirrored left to right if it is on the bottom)
C0603 = smd 1.1 x 1: 1 -0.85,0; 2 0.85,0
C0805 = smd 1.3 x 1.5: 1 -0.95,0; 2 0.95,0
C0402 = smd 0.7 x 0.9: 1 -0.65,0; 2 0.65,0
SOD323_ST = smd 0.8 x 0.6: A 1.25,0; C -1.25,0
3,6 = hole 3.6: 0,0
SO-08 = smd 0.6 x 2.2: 1 -1.905,-2.6; 2 -0.635,-2.6; 3 0.635,-2.6; 4 1.905,-2.6; 5 1.905,2.6; 6 0.635,2.6; 7 -0.635,2.6; 8 -1.905,2.6
USB-MICRO-10103594 = smd 0.4 x 1.6: D+ 0,0; D- -0.65,0; GND 1.3,0; ID 0.65,0; VBUS -1.3,0 | smd 1.9 x 1.9: SHLD1 -1.2,-2.55; SHLD2 1.2,-2.55; SHLD3 -4.15,-2.55; SHLD4 4.15,-2.55 | smd 2.1 x 1.6: SHLD5 3.1,0; SHLD6 -3.1,0
M0805 = smd 1.3 x 1.6: 1 -0.95,0; 2 0.95,0
SML0603 = smd 0.8 x 0.8: A 0.75,0; C -0.75,0
SOT23-3 = smd 0.8 x 0.9: 1 -0.95,-1; 2 0.95,-1; 3 0,1.1
SMD_4PIN_3.2X2.1 = smd 1.3 x 1.1: 1 -1.15,-0.9; 2 1.15,-0.9; 3 1.15,0.9; 4 -1.15,0.9
R0805 = smd 1.3 x 1.5: 1 -0.95,0; 2 0.95,0
R0603 = smd 1 x 1.1: 1 -0.85,0; 2 0.85,0
R2010 = smd 1.8 x 2.7: 1 -2.2,0; 2 2.2,0
TACTILE_SWITCH_SMD_6.2MM_TALL = smd 1.55 x 1.3: A1 -3.975,-2.25; A2 3.975,-2.25; B1 -3.975,2.25; B2 3.975,2.25
02P = drill 1.778 long: 1 -2.5,0; 2 2.5,0
CP_40_7 = smd 0.762 x 0.305: 1 -2.972,2.25; 2 -2.972,1.75; 3 -2.972,1.25; 4 -2.972,0.75; 5 -2.972,0.25; 6 -2.972,-0.25; 7 -2.972,-0.75; 8 -2.972,-1.25; 9 -2.972,-1.75; 10 -2.972,-2.25; 21 2.972,-2.25; 22 2.972,-1.75; 23 2.972,-1.25; 24 2.972,-0.75; 25 2.972,-0.25; 26 2.972,0.25; 27 2.972,0.75; 28 2.972,1.25; 29 2.972,1.75; 30 2.972,2.25 | smd 0.305 x 0.762: 11 -2.25,-2.972; 12 -1.75,-2.972; 13 -1.25,-2.972; 14 -0.75,-2.972; 15 -0.25,-2.972; 16 0.25,-2.972; 17 0.75,-2.972; 18 1.25,-2.972; 19 1.75,-2.972; 20 2.25,-2.972; 31 2.25,2.972; 32 1.75,2.972; 33 1.25,2.972; 34 0.75,2.972; 35 0.25,2.972; 36 -0.25,2.972; 37 -0.75,2.972; 38 -1.25,2.972; 39 -1.75,2.972; 40 -2.25,2.972 | smd 4.699 x 4.699: 41 0,0
RI_16_1 = smd 2.306 x 0.561: 1 -4.527,4.445; 2 -4.527,3.175; 3 -4.527,1.905; 4 -4.527,0.635; 5 -4.527,-0.635; 6 -4.527,-1.905; 7 -4.527,-3.175; 8 -4.527,-4.445; 9 4.527,-4.445; 10 4.527,-3.175; 11 4.527,-1.905; 12 4.527,-0.635; 13 4.527,0.635; 14 4.527,1.905; 15 4.527,3.175; 16 4.527,4.445
PW0014A_N = smd 0.95 x 0.45: 1 -2.95,1.95; 2 -2.95,1.3; 3 -2.95,0.65; 4 -2.95,0; 5 -2.95,-0.65; 6 -2.95,-1.3; 7 -2.95,-1.95; 8 2.95,-1.95; 9 2.95,-1.3; 10 2.95,-0.65; 11 2.95,0; 12 2.95,0.65; 13 2.95,1.3; 14 2.95,1.95
UJ_5 = smd 1.321 x 0.559: 1 -1.168,0.95; 2 -1.168,0; 3 -1.168,-0.95; 4 1.168,-0.95; 5 1.168,0.95
RI_20_1 = smd 1.921 x 0.511: 1 -4.65,5.715; 2 -4.65,4.445; 3 -4.65,3.175; 4 -4.65,1.905; 5 -4.65,0.635; 6 -4.65,-0.635; 7 -4.65,-1.905; 8 -4.65,-3.175; 9 -4.65,-4.445; 10 -4.65,-5.715; 11 4.65,-5.715; 12 4.65,-4.445; 13 4.65,-3.175; 14 4.65,-1.905; 15 4.65,-0.635; 16 4.65,0.635; 17 4.65,1.905; 18 4.65,3.175; 19 4.65,4.445; 20 4.65,5.715
MODULE_ESP32-DEVKITC-32U = drill 1.02 long: 1 -12.7,22.85; 2 -12.7,20.31; 3 -12.7,17.77; 4 -12.7,15.23; 5 -12.7,12.69; 6 -12.7,10.15; 7 -12.7,7.61; 8 -12.7,5.07; 9 -12.7,2.53; 10 -12.7,-0.01; 11 -12.7,-2.55; 12 -12.7,-5.09; 13 -12.7,-7.63; 14 -12.7,-10.17; 15 -12.7,-12.71; 16 -12.7,-15.25; 17 -12.7,-17.79; 18 -12.7,-20.33; 19 -12.7,-22.87; 20 12.7,-22.87; 21 12.7,-20.33; 22 12.7,-17.79; 23 12.7,-15.25; 24 12.7,-12.71; 25 12.7,-10.17; 26 12.7,-7.63; 27 12.7,-5.09; 28 12.7,-2.55; 29 12.7,-0.01; 30 12.7,2.53; 31 12.7,5.07; 32 12.7,7.61; 33 12.7,10.15; 34 12.7,12.69; 35 12.7,15.23; 36 12.7,17.77; 37 12.7,20.31; 38 12.7,22.85

### Placement (x,y rotation side)
C1  83.82,58.93 270 top
C2  45.85,2.92 90 top
C3  70.82,29.46 90 top
C4  47.88,3.05 90 top
C5  44.96,10.54 270 top
C6  70.43,19.2 90 top
C7  81.66,58.8 270 top
C8  57.02,29.21 90 top
C11  54.81,7.47 270 top
C12  55.14,2.57 90 top
C15  22.1,62.23 270 top
C16  22.1,57.78 270 top
C17  22.1,49.53 270 top
C18  22.1,45.34 270 top
C19  25.27,48.9 180 top
C20  25.25,45.54 0 top
C21  21.84,38.48 270 top
C22  21.84,34.16 270 top
C23  31.88,23.5 90 top
C24  25.15,37.97 180 top
C25  25.15,34.67 0 top
C27  31.88,27.94 90 top
C29  25.27,61.72 180 top
C30  25.27,58.17 0 top
C37  48.77,26.42 0 top
C38  52.7,22.99 90 top
C39  47.5,47.12 270 top
C40  45.49,22.86 0 top
C41  34.42,32.13 270 top
C42  41.78,24 0 top
C43  47.24,39.12 180 top
C44  45.97,24.89 0 top
C45  36.45,32.13 270 top
C46  42.04,26.16 0 top
C47  47.24,36.96 180 top
C48  76.33,14.71 90 top
C49  72.85,12.45 90 top
C50  57.23,3.15 90 top
C51  56.67,7.72 270 top
C52  36.2,25.65 270 top
C53  81.03,7.37 270 top
C56  71.88,43.31 0 top
C61  47.12,10.67 270 top
C62  113.54,14.99 90 top
C63  115.95,15.11 90 top
D1  72.64,46.61 270 top
D2  87.25,20.83 180 top
DRILEGEND  [DRILEGEND]  12.31,-38.08 0 top  (outside the outline)
H1  6.6,6.35 0 top
H2  53.09,59.82 0 top
H3  116.71,59.69 0 top
H4  116.08,6.48 0 top
IC1  89.53,61.85 90 top
J9  118.36,17.3 90 top
L1  10.16,19.18 0 top
L2  14.73,28.7 0 top
LED1  20.07,9.14 270 top
LED5  34.92,9.14 270 top
LED6  26.16,9.14 270 top
Q1  18.54,60.07 270 top
Q2  14.99,60.07 90 top
Q3  18.54,47.24 270 top
Q4  14.99,47.24 90 top
Q5  18.41,36.32 270 top
Q6  14.86,36.32 90 top
Q8  49.4,23.11 90 top
R1  11.81,62.87 270 top
R2  11.81,57.15 270 top
R3  11.81,50.16 270 top
R4  11.81,44.32 270 top
R5  19.43,51.18 0 top
R6  19.43,43.05 180 top
R7  25.27,51.44 0 top
R8  25.27,43.05 0 top
R9  24.51,21.59 270 top
R10  11.68,39.37 270 top
R11  11.68,33.4 270 top
R12  14.35,21.59 90 top
R13  19.43,24.26 0 top
R14  19.3,40.64 0 top
R15  19.3,32.13 180 top
R16  25.27,40.64 0 top
R17  25.15,32.13 0 top
R18  29.34,18.92 0 top
R19  85.85,27.69 270 top
R20  98.55,45.47 270 top
R21  19.43,64.14 0 top
R22  19.43,55.88 180 top
R23  88.39,45.59 270 top
R24  80.77,45.59 270 top
R25  90.93,27.69 90 top
R26  93.47,27.69 90 top
R29  34.04,23.5 270 top
R33  33.91,27.94 90 top
R35  25.4,64.14 0 top
R36  25.4,55.88 0 top
R43  49.53,47.12 90 top
R44  20.07,5.97 270 top
R45  26.16,5.97 270 top
R48  52.7,37.97 270 top
R50  34.92,5.97 270 top
R53  71.88,41.27 0 top
R54  50.8,35.18 180 top
R57  98.17,58.04 0 top
R58  98.17,60.07 0 top
R61  98.17,64.14 0 top
R62  98.17,62.1 0 top
R69  106.17,45.85 270 top
S2  84.71,16.13 0 top
SL1  4.57,60.07 270 top
SL2  4.57,47.37 270 top
SL3  4.7,36.96 270 top
SL5  4.7,26.16 90 top
U1  44.58,30.73 270 top
U2  63.55,13.11 180 top
U3  51.79,13.64 180 top
U4  51.36,2.95 180 top
U5  63.75,34.42 180 top
U6  76.25,5.23 0 top
U7  98.55,36.58 90 top

### Tracks (layer width: path | path; a pad name or v marks a point on that pad's centre or on a via)
5V_ADE  (via drill 0.38)  (3 unrouted)
  Top 0.254: v56.77,16.26 56.55,16.26 56.52,16.28 U2.10 | 59.15,5.71 v59.18,5.71 | U2.16 58.93,8.57 | C51.1 56.51,8.42
  Top 0.406: U2.16 56.76,8.66 C51.1 54.97,8.57 C11.1
  Top 0.508: U4.1 54.86,2 C12.1 56.74,1.72 C50.1 57.78,1.65 59.15,1.65 59.15,5.71 59.15,8.53 U2.16 58.26,8.66 | 52.66,3.9 U4.3 52.53,4.62 51.56,5.59 v49.15,5.59 | U3.14 49.15,11.38 v49.15,9.53
  Bottom 0.254: v59.18,5.71 59.18,13.84 v56.77,16.26
  Bottom 0.508: v49.15,9.53 v49.15,5.59
+3V3  (via drill 0.38)
  Top 0.254: 57.36,28.7 C8.1 | 47.75,34.54 v47.5,34.54 48.01,34.54 48.64,35.18 R54.2 49.95,41.62 49.53,42.04 | U1.4 45.33,42.41 45.34,42.42 49.15,42.42 49.53,42.04 | R43.1 49.53,42.04
  Top 0.305: 46.86,23.86 46.86,24.85 C44.2 | 46.44,21.84 C40.2 | U1.1 46.83,34.38 46.99,34.54 v47.5,34.54
  Top 0.381: 47.88,2.12 C4.1 | 34.92,3.81 40.84,3.81 42.94,1.72 v44.21,1.72 | 34.92,3.81 26.16,3.81 | 26.16,3.81 20.7,3.81 20.07,4.45 R44.2 | R45.2 26.16,3.81 | R50.2 34.92,3.81
  Top 0.406: C44.2 46.82,23.24 C40.2 46.44,21.97 | v52.83,20.83 52.45,20.45 47.84,20.45 46.44,21.84 | v57.02,20.83 C8.1 | U5.20 57.36,28.7 | U1.27 45.33,27.04 v44.83,26.54
  Top 0.508: U4.5 47.88,2 C4.1 46.07,2.2 C2.1 44.46,1.97 v44.21,1.72 | v45.59,20.95 45.59,21.12 46.44,21.97 | C44.2 46.82,25.5 45.78,26.54 v44.83,26.54
  Bottom 0.254: v44.83,26.54 45.47,26.54 47.37,28.45 47.37,34.16 v47.5,34.54
  Bottom 0.406: v52.83,20.83 v57.02,20.83
  Bottom 0.508: v45.59,20.95 45.47,20.95 44.07,19.56 44.07,2.29 44.08,2.28 v44.21,1.72
AVDDOUT
  Top 0.254: U1.25 44.33,27.18 43.31,26.16 C46.2 42.63,25.91 C42.2
DREADY_ADE
  Top 0.254: 54.42,14.29 U3.5 53.98,14.29 53.59,14.67 53.59,17.91 55.63,19.94 55.63,27.56 53.21,29.97 50.55,29.97 49.53,30.98 U1.36
DVDDOUT
  Top 0.254: U1.3 45.83,35.41 46.1,35.69 46.1,36.66 C47.2 C43.2
GND  (71 unrouted)
  pour Top (isolate 0.381): 0.13,66.04 59.94,66.04 59.94,0.13 0.13,0.13
  pour Bottom (isolate 0.381): 59.94,66.04 0.13,66.04 0.13,0.13 59.94,0.13
GNDA  (28 unrouted)
  pour Bottom (isolate 0.381): 67.56,0.13 67.56,65.66 123.1,65.66 123.1,0.13
  pour Top (isolate 0.381): 123.06,65.66 67.56,65.66 67.56,0.13 123.06,0.13
IAN
  Top 0.254: 26.42,58.17 C30.2 | U1.8 43.31,33.73 43.31,37.97 37.85,43.43 37.85,49.53 29.21,58.17 C30.2 | C30.2 26.25,58.17
  Top 0.508: 26.25,58.17 R36.2
IAP
  Top 0.254: U1.7 43.81,38.23 38.48,43.56 38.48,50.04 26.8,61.72 C29.1 | R35.2 26.22,64.14
  Top 0.508: 26.22,64.14 C29.1
IBN
  Top 0.254: U1.10 42.32,34.42 42.16,34.57 42.16,35.18 34.92,42.42 34.92,46.48 34.67,46.74 29.08,46.74 27.89,45.54 C20.2 | 26.1,43.46 R8.2 26.2,43.05
  Top 0.508: 26.2,43.05 C20.2
IBP
  Top 0.254: U1.9 42.8,33.73 42.8,35.31 35.56,42.55 35.56,46.86 35.05,47.37 29.08,47.37 27.56,48.9 C19.1 | R7.2 26.22,51.44
  Top 0.508: 26.22,51.44 C19.1
ICN
  Top 0.254: U1.12 41.58,32.51 38.73,32.51 35.31,35.94 28.32,35.94 27.05,34.67 C25.2 26,34.67
  Top 0.508: 26,34.67 R17.2
ICP
  Top 0.254: C24.1 26.92,37.97 28.45,36.45 35.56,36.45 38.99,33.02 41.57,33.02 U1.11 | R16.2 26.1,40.64
  Top 0.508: 26.1,40.64 C24.1
IRQ0_ADE
  Top 0.254: U1.31 52.41,28.48 53.98,26.92 53.98,20.83 51.69,18.54 | 51.69,18.54 50.67,17.53 50.67,15.24 50.37,14.94 U3.9 | 51.69,18.54 36.2,18.54 28.84,11.18 20.71,11.18 20.07,10.54 LED1.C
IRQ0_ISO
  Top 0.254: U6.3 73.81,5.88
  Top 0.406: 73.81,5.88 74.57,6.64 74.57,10.2 75.87,11.5 89.28,11.5 90.94,13.17 U7.7 90.94,26.83 R25.1
IRQ1_ADE  (via drill 0.38)
  Top 0.254: U1.32 52.68,28.98 54.48,27.18 54.48,20.32 51.82,17.65 v51.82,17.27 51.82,13.84 50.96,12.99 U3.12 | v47.88,17.27 36.32,17.27 29.59,10.54 26.29,10.54 26.16,10.41 LED6.C
  Bottom 0.254: v47.88,17.27 v51.82,17.27
IRQ1_ISO
  Top 0.305: R26.1 93.38,26.75
  Top 0.406: U6.6 73.34,3.89 75.27,3.89 75.27,9.87 76.19,10.79 90.93,10.79 93.48,13.35 U7.8 93.47,23.89 R26.1
MISO_ADE  (via drill 0.61)
  Top 0.254: U5.16 v56.64,33.78 | v54.23,32.51 53.7,31.98 U1.38
  Bottom 0.254: v56.64,33.78 56.01,33.78 54.74,32.51 v54.23,32.51
MISO_ISO
  Top 0.406: U5.5 72.01,33.78 76.96,38.73 76.96,51.69 92.58,51.69 93.48,50.79 U7.31
MODE_BUT
  Top 0.406: R19.2 85.86,26.83 U7.5 85.85,23.87 D2.A
MOSI_ADE
  Top 0.254: U5.17 56.13,32.51 54.99,33.66 53.72,33.66 52.55,32.48 U1.39
MOSI_ISO
  Top 0.406: U5.4 73.41,32.51 78.24,37.35 U7.37
N$1
  Top 0.254: U1.29 46.36,27.73 46.36,26.8 46.74,26.42 C37.1 48.12,24.65 Q8.3
N$2
  Top 0.254: U1.30 51.36,27.76 51.82,27.3 51.82,22.46 51.94,22.34 | 51.94,22.34 C38.1 | 51.94,22.34 50.68,22.34 Q8.1
N$3
  Top 0.254: 11.49,51.05 R3.1 11.81,51.18 | Q4.2 16,48.19
  Top 0.508: SL2.1 6.82,49.87 8,51.05 11.49,51.05 | R5.1 16,51.18 | 16,51.18 11.81,51.18 | 16,48.19 16,51.18 | Q3.1 Q4.2
N$4
  Top 0.254: 11.49,43.43 R4.2 | Q4.1 16,46.29 | 16,43.94 16,43.75
  Top 0.508: SL2.2 6.56,44.87 8,43.43 11.49,43.43 | Q3.2 Q4.1 | 16,46.29 16,43.94 16,42.99 | 16,42.99 12.19,42.99 R4.2 | R6.2 18.52,42.99 16,42.99
N$6
  Top 0.254: C18.2 21.84,44.39
  Top 0.508: 21.84,43.05 R6.1 | 21.84,43.05 R8.1 | 21.84,44.39 21.84,43.05
N$7
  Top 0.254: Q1.1 Q2.2 15.88,61.02 | 11.81,64.14 R1.1
  Top 0.508: SL1.1 6.82,62.57 8.25,64.01 11.62,64.01 R1.1 | 15.88,64.14 R21.1 | 15.88,64.14 11.81,64.14 | 15.88,61.02 15.88,64.14
N$8
  Top 0.406: IC1.3 96.94,62.48 R62.1 R61.1
N$9
  Top 0.508: 22.1,51.44 20.66,51.44 20.41,51.18 R5.2 | 22.1,51.44 R7.1 | C17.1 22.1,51.44
N$10
  Top 0.406: D2.C 88.5,18.56 S2.B2
N$11
  Top 0.254: 15.49,37.27 Q6.2 | Q6.2 Q5.1 | Q6.2 15.88,37.27 | 18.45,40.32 R14.1
  Top 0.508: SL3.1 6.94,39.46 7.87,40.39 11.62,40.39 R10.1 15.88,40.32 | 15.88,40.32 18.45,40.32 | 15.88,37.27 15.88,40.32
N$13
  Top 0.254: 8.89,32.45 8.88,32.39 | Q5.2 Q6.1 15.88,35.37 | 18.45,32.45 R15.2
  Top 0.508: SL3.2 6.82,34.46 8.88,32.39 | 8.89,32.45 R11.2 15.88,32.45 | 15.88,35.37 15.88,33.02 15.88,32.45 | 15.88,32.45 18.45,32.45
N$14
  Top 0.254: 22.1,55.88 C16.2
  Top 0.508: R22.1 22.1,55.88 R36.1
N$15
  Top 0.508: L2.1 5.02,28.7 4.98,28.66 SL5.2
N$17
  Top 0.508: 21.84,32.13 R15.1 | 21.84,32.13 R17.1 | C22.2 21.84,32.13
N$18
  Top 0.254: C21.1 22.1,39.43
  Top 0.508: 22.1,40.64 R14.2 | 22.1,40.64 R16.1 | 22.1,39.43 22.1,40.64
N$27
  Top 0.254: LED1.A R44.1
N$28
  Top 0.254: LED6.A R45.1
N$30
  Top 0.254: U3.8 43.38,15.59 42.67,14.88 42.67,7.37 43.18,6.86 49.29,6.86 52.34,9.91 55.77,9.91 57.16,11.3 58.93,11.3 U2.14
N$31
  Top 0.254: U3.11 44.32,13.64 43.56,12.88 43.56,8.26 44.2,7.62 49.4,7.62 52.2,10.41 55.63,10.41 57.68,12.47 U2.13
N$35
  Top 0.254: 14.14,19.18 R12.1
  Top 0.508: L1.2 14.14,19.18
N$36
  Top 0.254: 16.76,23.79 R13.1
  Top 0.508: R12.2 16.76,23.79
N$37
  Top 0.508: R13.2 24.04,24.26 R9.1
N$38
  Top 0.254: 27.22,19.39 R18.1
  Top 0.508: R9.2 27.22,19.39
N$40
  Top 0.254: 11.49,56.13 R2.2 | Q1.2 Q2.1 16,59.12 | 18.58,56.2 R22.2
  Top 0.508: SL1.2 6.56,57.57 8,56.13 11.49,56.13 | 16,56.2 R2.2 | 16,56.2 18.58,56.2 | 16,59.12 16,56.2
N$41
  Top 0.254: 22.1,63.88 C15.1
  Top 0.508: 22.1,64.14 R21.2 | 22.1,64.14 R35.1 | C15.1 22.1,64.14
N$44
  Top 0.254: U3.3 55.88,12.99 56.48,13.59 59.02,13.59 U2.12
N$49
  Top 0.254: U2.11 58.95,14.94 U3.6
N$50
  Top 0.254: LED5.A R50.1
N$57  (via drill 0.38)  (1 unrouted)
  Top 0.254: U6.2 73.23,6.6
  Top 0.406: v72.9,14.86 72.87,14.88 72.65,14.88 68.97,11.2 U2.3 | 72.26,8.13 72.26,6.93 72.67,6.53 U6.2
  Bottom 0.254: 72.14,8.38 v72.26,8.26
  Bottom 0.406: v72.9,14.86 72.14,14.1 72.14,8.38
N$58  (via drill 0.38)
  Top 0.254: U6.5 73.18,4.7
  Top 0.406: v73.03,16.13 72.88,16.13 69.22,12.47 U2.4 | v70.61,6.99 70.61,5.24 71.27,4.58 U6.5
  Bottom 0.254: v73.03,16.13 72.9,16.13
  Bottom 0.406: 72.9,16.13 70.67,13.9 v70.61,6.99
N$59  (via drill 0.38)
  Top 0.254: U6.9
  Top 0.406: U2.5 68.84,13.74 72.52,17.42 74.27,17.42 v74.3,17.4 | v76.45,7.11 76.45,4.19 76.71,3.94 U6.9
  Bottom 0.254: 76.45,7.49 v76.45,7.11
  Bottom 0.406: v74.3,17.4 74.3,14.35 73.03,13.08 73.03,10.92 76.45,7.49
N$60  (via drill 0.38)
  Top 0.254: 79.16,5.84 U6.12
  Top 0.406: v75.18,18.92 74.7,18.44 72.65,18.44 69.22,15.01 U2.6 | v77.85,7.11 77.85,6.1 78.11,5.84 79.16,5.84
  Bottom 0.254: v77.85,7.11 77.85,7.49 77.72,7.62
  Bottom 0.406: v75.18,18.92 77.72,16.38 77.72,7.62
N$67
  Top 0.508: L1.1 4.73,23.66 SL5.1
N$76
  Top 0.254: 92.33,59.75 IC1.1 | 97.32,59.6 R58.1
  Top 0.406: IC1.1 97.19,59.94 R58.1 R57.1
PM1_ADE  (via drill 0.38)
  Top 0.254: U5.14 52.7,36.32 | 52.7,36.32 51.44,36.32 50.93,36.83 v50.93,42.29 | R48.2 52.7,36.32 | U1.5 44.83,43.05 v45.47,43.69
  Bottom 0.254: v50.93,42.29 49.91,43.31 45.85,43.31 v45.47,43.69
PM1_ISO
  Top 0.406: U5.7 71.5,36.32 74.04,38.86 74.04,53.09 104.52,53.09 106.18,51.42 U7.26 106.17,49.27 R69.1
REF
  Top 0.254: U1.16 41.48,30.61 38.23,30.61 37.55,31.28 C45.2 C41.2
RESET_ADE
  Top 0.254: U1.6 44.33,47.63 44.66,47.97 C39.1 R43.2 51.09,47.97 55.12,43.94 55.12,38.35 55.88,37.59 U5.13
RESET_ESP  (1 unrouted)
  Top 0.254: 72.66,47.88 D1.C
  Top 0.406: D1.C 73.28,48.49 73.28,53.85 106.17,53.85 107.44,52.58 107.44,37.08 96.01,25.65
RESET_ISO
  Top 0.406: U5.8 71.33,37.59 72.73,39 R53.2 C56.2 72.73,45.27 D1.A
SCL_ARDUINO  (via drill 0.61)
  Top 0.406: IC1.6 v82.8,62.48 | U7.36 80.78,46.45 R24.1
  Bottom 0.406: v82.8,62.48 80.78,60.46 U7.36
SCLK_ADE
  Top 0.254: U5.18 57.43,31.24 57.19,31.48 U1.37
SCLK_ISO
  Top 0.406: U5.3 75.31,31.24 80.01,35.94 92.96,35.94 96.02,39 U7.30
SDA_ARDUINO  (via drill 0.61)
  Top 0.406: IC1.5 v81.28,63.75 | R23.1 88.39,49.27 U7.33
  Bottom 0.406: v81.28,63.75 88.4,63.75 U7.33
SS_ADE
  Top 0.254: 58.98,35.18 U5.15 51.65,35.05 | U1.40 47.59,33.02 49.78,33.02 51.65,34.89 51.65,35.05 | R54.1 51.65,35.05
SS_ISO  (via drill 0.61)
  Top 0.406: v73.03,36.32 71.75,35.05 U5.6 | R20.1 98.55,49.27 U7.29
  Bottom 0.406: v73.03,36.32 73.66,36.96 73.66,39.12 75.06,40.51 97.03,40.51 98.56,42.05 U7.29
V+  (via drill 0.38, 0.61)
  Top 0.254: 80.94,8.13 C53.1 | 99.1,59.99 99.04,60.05 R58.2
  Top 0.406: 86.77,59.78 IC1.8 83.99,59.94 C1.1 81.69,59.78 | R25.2 R26.2 98.55,33.62 R20.2 | 90.55,28.16 R25.2 | U5.1 70.79,28.7 | C3.1 72.86,28.61 v72.9,28.57 | v84.58,42.42 84.58,44.7 | 84.58,44.7 84.54,44.74 R24.2 | 84.58,44.7 84.62,44.74 R23.2 | 81.69,59.78 C7.1 | v70.99,39.5 71.03,39.54 R53.1 C56.1 71.03,52.62 78.19,59.78 81.69,59.78 | v102.49,61.09 99.06,61.09 | 99.06,61.09 99.02,61.13 R62.2 | 99.06,61.09 99.04,61.07 99.04,60.05 | U7.1 75.7,27.68 75.69,27.69 76.54,28.54 R19.1 R25.2
  Top 0.508: 71.11,28.57 C3.1 70.79,28.7 | v82.68,8.26 81.06,8.26 C53.1 79.34,8.22 79.12,8 79.12,7.26 U6.14
  Bottom 0.406: v70.99,39.5 70.99,41.78 71.63,42.42 v84.58,42.42 93.85,42.42 94.74,43.31 94.74,53.34 v102.49,61.09
  Bottom 0.508: v82.68,8.26 81.62,9.31 79.08,9.31 78.78,9.61 78.78,17.11 72.9,23 72.9,23.88 | 72.9,23.88 v72.9,28.57 71.12,28.57 70.99,28.7 v70.99,39.5 | U7.1 72.9,23.88
VAN
  Top 0.254: U1.19 41.58,28.96 40.26,28.96 37.61,26.3 C52.1 35.55,26.3 35.31,26.54 35.31,26.92 35.14,27.09 R33.1 31.88,27.08 C27.1
VAP
  Top 0.254: U1.20 41.57,28.45 40.64,28.45 37.2,25 C52.2 35.93,25 35.56,24.64 35.56,22.99 35.22,22.64 R29.2 33.95,23.07 33.95,22.26 | R18.2 31.5,19.85 | 31.88,22.64 C23.1 31.54,22.55
  Top 0.508: R29.2 31.88,22.64 | 31.54,22.55 R18.2
VCC  (via drill 0.38)
  Top 0.254: J9.VBUS 118.24,16 118.2,15.96
  Top 0.406: v74.04,11.68 73.95,11.6 C49.1 | C48.1 77.64,13.76 77.98,14.1 77.98,18.8 76.83,19.94 71.88,19.94 71.5,19.56 71.5,19.05 70.81,18.36 70.43,18.36
  Top 0.508: C48.1 74.25,11.68 v74.04,11.68 | C49.1 71.78,11.6 68.84,8.66 U2.1 | U2.7 69.22,16.28 70.43,17.49 C6.1 70.43,18.36 | J9.VBUS 115.98,16 C63.2 114.81,15.96 | 114.81,15.96 113.56,15.96 C62.2 113.54,15.68 106.36,15.68 100.71,10.03 77.09,10.03 v76.71,9.65 | 114.81,15.96 114.81,19.29 117.64,22.12 117.64,25.18 119.13,26.67 120.27,26.67 121.42,25.52 U7.19
  Bottom 0.508: v76.71,9.65 76.58,9.53 76.2,9.53 v74.04,11.68
ZX_ADE
  Top 0.254: U1.35 49.27,30.48 50.29,29.46 52.96,29.46 55.12,27.3 55.12,20.19 52.96,18.03 52.96,12.57 53.14,12.39 54.69,12.39 U3.2

### Text on the board
tPlace: ADE9000_RESET | IA | CAUTION! HIGH VOLTAGE | IB | SS_ADE | MISO_ADE | IC | MOSI_ADE | SCLK_ADE | NEUTRAL | * | IRQ0 | IRQ1 | GND_LIVE
bPlace: SCLK_ISO | SS_ISO
DrillLegend: DRILL LEGEND
FabDoc1: LAYER STACKUP: / --TOP SILKSCREEN / --TOP SOLDERMASK / --TOP LAYER / --BOTTOM LAYER / --BOTTOM SOLDERMASK / --BOTTOM SILKSCREEN / / NOMINAL FINISHED BOARD THICKNESS: 0.062" | PCB SPECIFICATIONS: / --SOLDERMASK: GREEN / --SILKSCREEN: WHITE / --MATERIAL: STANDARD FR4 / --SURFACE FINISH: ENIG / --FINISHED COPPER: 1 Oz